# EAGLE design iomodul2 (EAGLE 6.5.0)
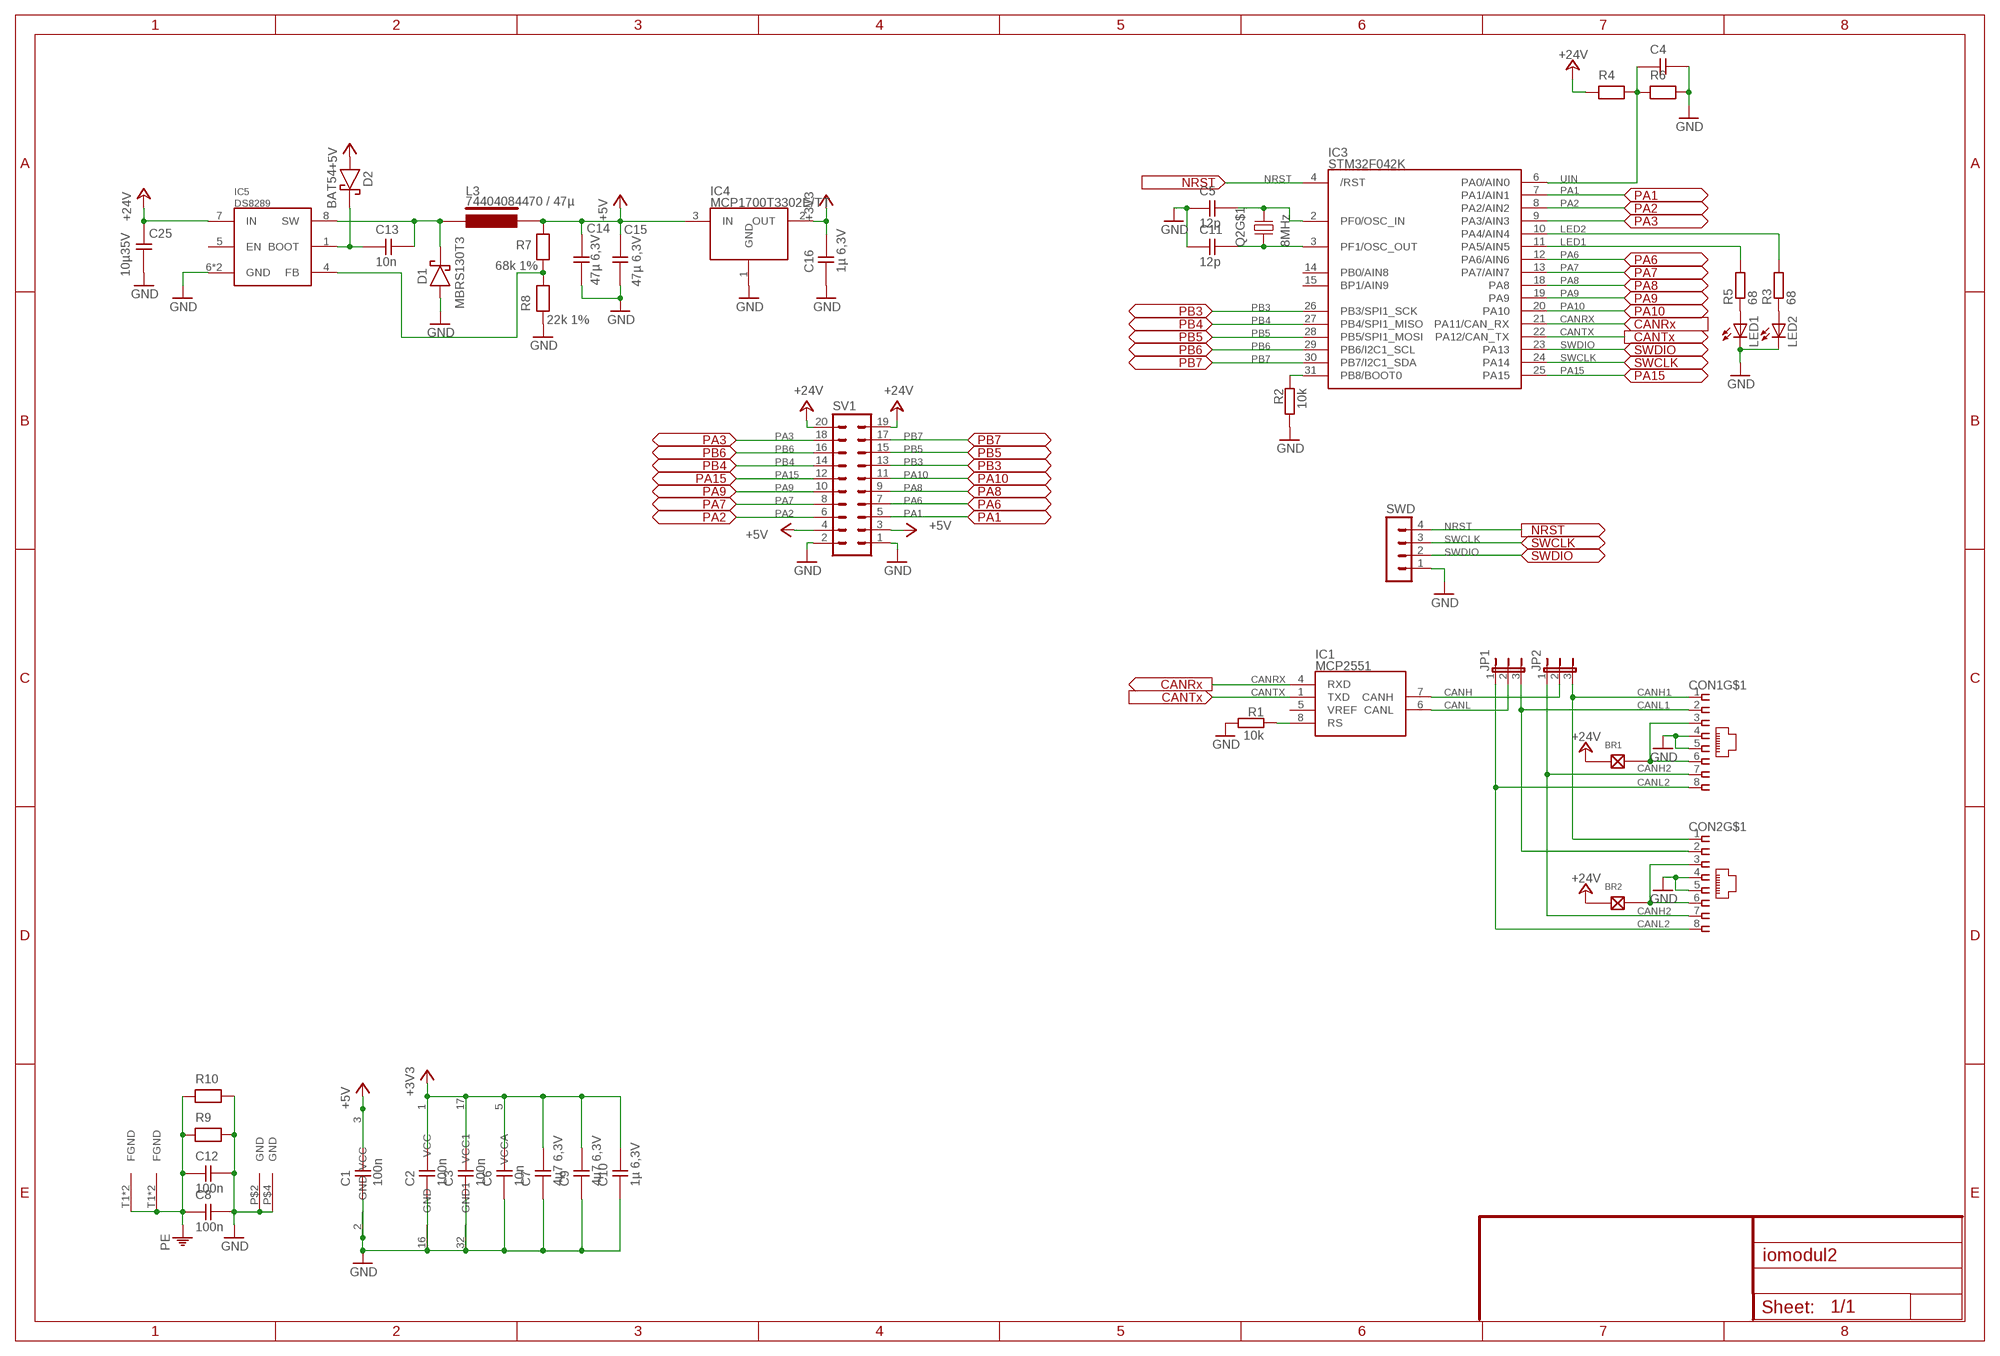
[diagram p0: schematic, sheet 1]

## Parts
BR1  LÖTBRÜCKE-S  [LÖTBRÜCKE]
BR2  LÖTBRÜCKE-S  [LÖTBRÜCKE]
C1  100n  CAP0603R  [0603REFLOW]
C2  100n  CAP0603R  [0603REFLOW]
C3  100n  CAP0603R  [0603REFLOW]
C4  CAP0603R  [0603REFLOW]
C5  12p  CAP0603R  [0603REFLOW]
C6  10n  CAP0603R  [0603REFLOW]
C7  4µ7 6,3V  CAP0603R  [0603REFLOW]
C8  100n  CAP0603R  [0603REFLOW]
C9  4µ7 6,3V  CAP0603R  [0603REFLOW]
C10  1µ 6,3V  CAP0603R  [0603REFLOW]
C11  12p  CAP0603R  [0603REFLOW]
C12  100n  CAP0603R  [0603REFLOW]
C13  10n  CAP0603R  [0603REFLOW]
C14  47µ 6,3V  CAP1210  [1210]
C15  47µ 6,3V  CAP1210  [1210]
C16  1µ 6,3V  CAP0603R  [0603REFLOW]
C25  10µ35V  CAP1206  [1206]
CON1  MEBP_8-8G  [MEBP]
CON2  MEBP_8-8G  [MEBP]
D1  MBRS130T3  [SMB]
D2  BAT54  [SOT23/32]
IC1  MCP2551  [SO-8]
IC3  STM32F042K  STM32F042  [LQFP32]
IC4  MCP1700T3302E/TT  MCP1700  [SOT23]
IC5  DS8289  [SO8-POWERPAD]
JP1  JP2E  [JP2]
JP2  JP2E  [JP2]
L3  74404084470 / 47µ  WE-LQS  [WE-LQS]
LED1  LEDCHIPLED_0603  [CHIPLED_0603]
LED2  LEDCHIPLED_0603  [CHIPLED_0603]
Q2  8MHz  MT-CRYSTAL  [MT-CRYSTAL]
R1  10k  R-EU_R0603  [R0603]
R2  10k  R-EU_R0603  [R0603]
R3  68  R-EU_R0603  [R0603]
R4  RES0603R  [0603REFLOW]
R5  68  R-EU_R0603  [R0603]
R6  RES0603R  [0603REFLOW]
R7  68k 1%  RES0603R  [0603REFLOW]
R8  22k 1%  RES0603R  [0603REFLOW]
R9  RES0603R  [0603REFLOW]
R10  RES0603R  [0603REFLOW]
SV1  MA10-2  [MA10-2]
SWD  MA04-1  [MA04-1]

## Nets
+3V3: C2.2 C3.2 C6.2 C7.2 C9.2 C10.2 C16.2 IC3.1(VCC) IC3.5(VCCA) IC3.17(VCC1) IC4.2(OUT)
+5V: C1.2 C14.2 C15.2 D2.1(A) IC1.3(VCC) IC4.3(IN) L3.P$2 R7.2 SV1.3 SV1.4
+24V: BR1.1 BR2.1 C25.2 IC5.7(IN) R4.1 SV1.19 SV1.20
CANH: IC1.7(CANH) JP2.2
CANH1: CON1.1 CON2.1 JP2.3
CANH2: CON1.7 CON2.7 JP2.1
CANL: IC1.6(CANL) JP1.2
CANL1: CON1.2 CON2.2 JP1.3
CANL2: CON1.8 CON2.8 JP1.1
CANRX: IC1.4(RXD) IC3.21(PA11/CAN_RX)
CANTX: IC1.1(TXD) IC3.22(PA12/CAN_TX)
GND: C1.1 C2.1 C3.1 C4.2 C5.1 C6.1 C7.1 C8.2 C9.1 C10.1 C11.1 C12.2 C14.1 C15.1 C16.1 C25.1 CON1.4 CON1.5 CON2.4 CON2.5 D1.A IC1.2(GND) IC3.16(GND) IC3.32(GND1) IC4.1(GND) IC5.6(GND) IC5.TP(GND) LED1.C LED2.C Q2.P$2(GND) Q2.P$4(GND) R1.2 R2.2 R6.2 R8.1 R9.2 R10.2 SV1.1 SV1.2 SWD.1
LED1: IC3.11(PA5/AIN5) R5.2
LED2: IC3.10(PA4/AIN4) R3.2
N$1: IC1.8(RS) R1.1
N$2: BR1.2 CON1.3 CON1.6
N$3: LED2.A R3.1
N$4: C11.2 IC3.3(PF1/OSC_OUT) Q2.P$1
N$5: C5.2 IC3.2(PF0/OSC_IN) Q2.P$3
N$6: BR2.2 CON2.3 CON2.6
N$7: LED1.A R5.1
N$12: C13.1 D2.3(K) IC5.1(BOOT)
N$13: C13.2 D1.K IC5.8(SW) L3.P$1
N$15: IC3.31(PB8/BOOT0) R2.1
N$18: IC5.4(FB) R7.1 R8.2
NRST: IC3.4(/RST) SWD.4
PA1: IC3.7(PA1/AIN1) SV1.5
PA2: IC3.8(PA2/AIN2) SV1.6
PA3: IC3.9(PA3/AIN3) SV1.18
PA6: IC3.12(PA6/AIN6) SV1.7
PA7: IC3.13(PA7/AIN7) SV1.8
PA8: IC3.18(PA8) SV1.9
PA9: IC3.19(PA9) SV1.10
PA10: IC3.20(PA10) SV1.11
PA15: IC3.25(PA15) SV1.12
PB3: IC3.26(PB3/SPI1_SCK) SV1.13
PB4: IC3.27(PB4/SPI1_MISO) SV1.14
PB5: IC3.28(PB5/SPI1_MOSI) SV1.15
PB6: IC3.29(PB6/I2C1_SCL) SV1.16
PB7: IC3.30(PB7/I2C1_SDA) SV1.17
PE: C8.1 C12.1 CON1.T1(FGND) CON1.T2(FGND) CON2.T1(FGND) CON2.T2(FGND) R9.1 R10.1
SWCLK: IC3.24(PA14) SWD.3
SWDIO: IC3.23(PA13) SWD.2
UIN: C4.1 IC3.6(PA0/AIN0) R4.2 R6.1
Unconnected: IC1.5(VREF) IC3.14(PB0/AIN8) IC3.15(BP1/AIN9) IC5.5(EN)

## Library data of the parts
BR1 BR2 = myspecial:LÖTBRÜCKE
C1-C13 C16 = mypassive-bleifrei:CAP0603
C14 C15 = MYPASS:CAP1210
C25 = MYPASS:CAP1206
CON1 CON2 = myconn:MEBP_8-8G: Reichelt RJ45 geschirmt MEBP 8-8G
D1 = MYDISCR:MBRS130T3
D2 = MYDISCR:BAT54
IC1 = MYMCHIP:MCP2551: CAN Transceiver
IC3 = MYSGS:STM32F042
IC4 = MYMCHIP:MCP1700: LDO 250mA
IC5 = MYRichtek:DS8289
JP1 JP2 = jumper:JP2E: JUMPER
L3 = myinductiv:WE-LQS
LED1 LED2 = led:LED: LED OSRAM: - CHIPLED LG R971, LG N971, LY N971, LG Q971, LY Q971, LO R971, LY R971 LH N974, LH R974 LS Q976, LO Q976, LY Q976 LO Q996 - Hyper CHIPLED LW Q18S LB Q993, LB Q99A, LB R99A - SideLED LS A670, LO A670, LY A670, LG A670, LP A670 LB A673, LV A673, LT A673, LW A673 LH A674 LY A675 LS A676, LA A676, LO A676, LY A676, LW A676 LS A679, LY A679, LG A679 - Hyper Micro SIDELED® LS Y876, LA Y876, LO Y876, LY Y876 LT Y87S - SmartLED LW L88C, LW L88S LB L89C, LB L89S, LG L890 LS L89K, LO L89K, LY L89K LS L896, LA L896, LO L896, LY L896 - TOPLED LS T670, LO T670, LY T670, LG T670, LP T670 LSG T670, LSP T670, LSY T670, LOP T670, LYG T670 LG T671, LOG T671, LSG T671 LB T673, LV T673, LT T673, LW T673 LH T674 LS T676, LA T676, LO T676, LY T676, LB T676, LH T676, LSB T676, LW T676 LB T67C, LV T67C, LT T67C, LS T67K, LO T67K, LY T67K, LW E67C LS E67B, LA E67B, LO E67B, LY E67B, LB E67C, LV E67C, LT E67C LW T67C LS T679, LY T679, LG T679 LS T770, LO T770, LY T770, LG T770, LP T770 LB T773, LV T773, LT T773, LW T773 LH T774 LS E675, LA E675, LY E675, LS T675 LS T776, LA T776, LO T776, LY T776, LB T776 LHGB T686 LT T68C, LB T68C - Hyper Mini TOPLED® LB M676 - Mini TOPLED Santana® LG M470 LS M47K, LO M47K, LY M47K Source: http://www.osram.convergy.de LUXEON: - LUMILED® LXK2-PW12-R00, LXK2-PW12-S00, LXK2-PW14-U00, LXK2-PW14-V00 LXK2-PM12-R00, LXK2-PM12-S00, LXK2-PM14-U00 LXK2-PE12-Q00, LXK2-PE12-R00, LXK2-PE12-S00, LXK2-PE14-T00, LXK2-PE14-U00 LXK2-PB12-K00, LXK2-PB12-L00, LXK2-PB12-M00, LXK2-PB14-N00, LXK2-PB14-P00, LXK2-PB14-Q00 LXK2-PR12-L00, LXK2-PR12-M00, LXK2-PR14-Q00, LXK2-PR14-R00 LXK2-PD12-Q00, LXK2-PD12-R00, LXK2-PD12-S00 LXK2-PH12-R00, LXK2-PH12-S00 LXK2-PL12-P00, LXK2-PL12-Q00, LXK2-PL12-R00 Source: www.luxeon.com KINGBRIGHT: KA-3528ASYC Source: www.kingbright.com
Q2 = MYPASS:MT-CRYSTAL: 3,2 x 2,5mm Reichelt
R1-R3 R5 = rcl:R-EU_: RESISTOR, European symbol
R4 R6-R10 = mypassive-bleifrei:RES0603
SV1 = con-lstb:MA10-2: PIN HEADER; OC_FARNELL: unknown; OC_NEWARK: unknown
SWD = con-lstb:MA04-1: PIN HEADER; OC_FARNELL: unknown; OC_NEWARK: unknown

## Board
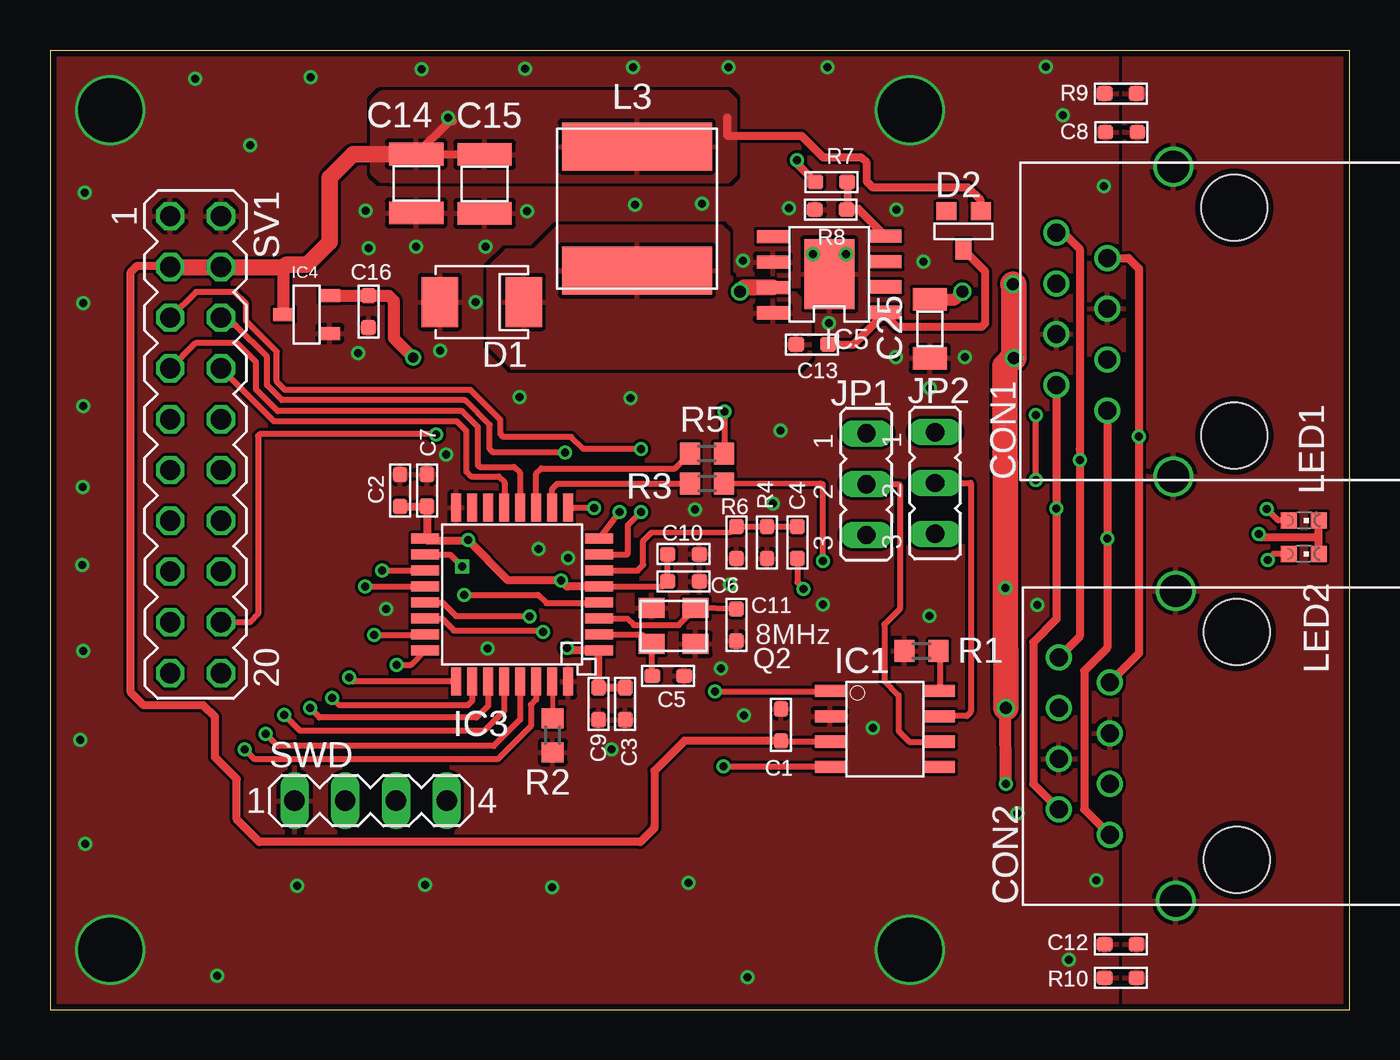
[diagram p1: board, top side]
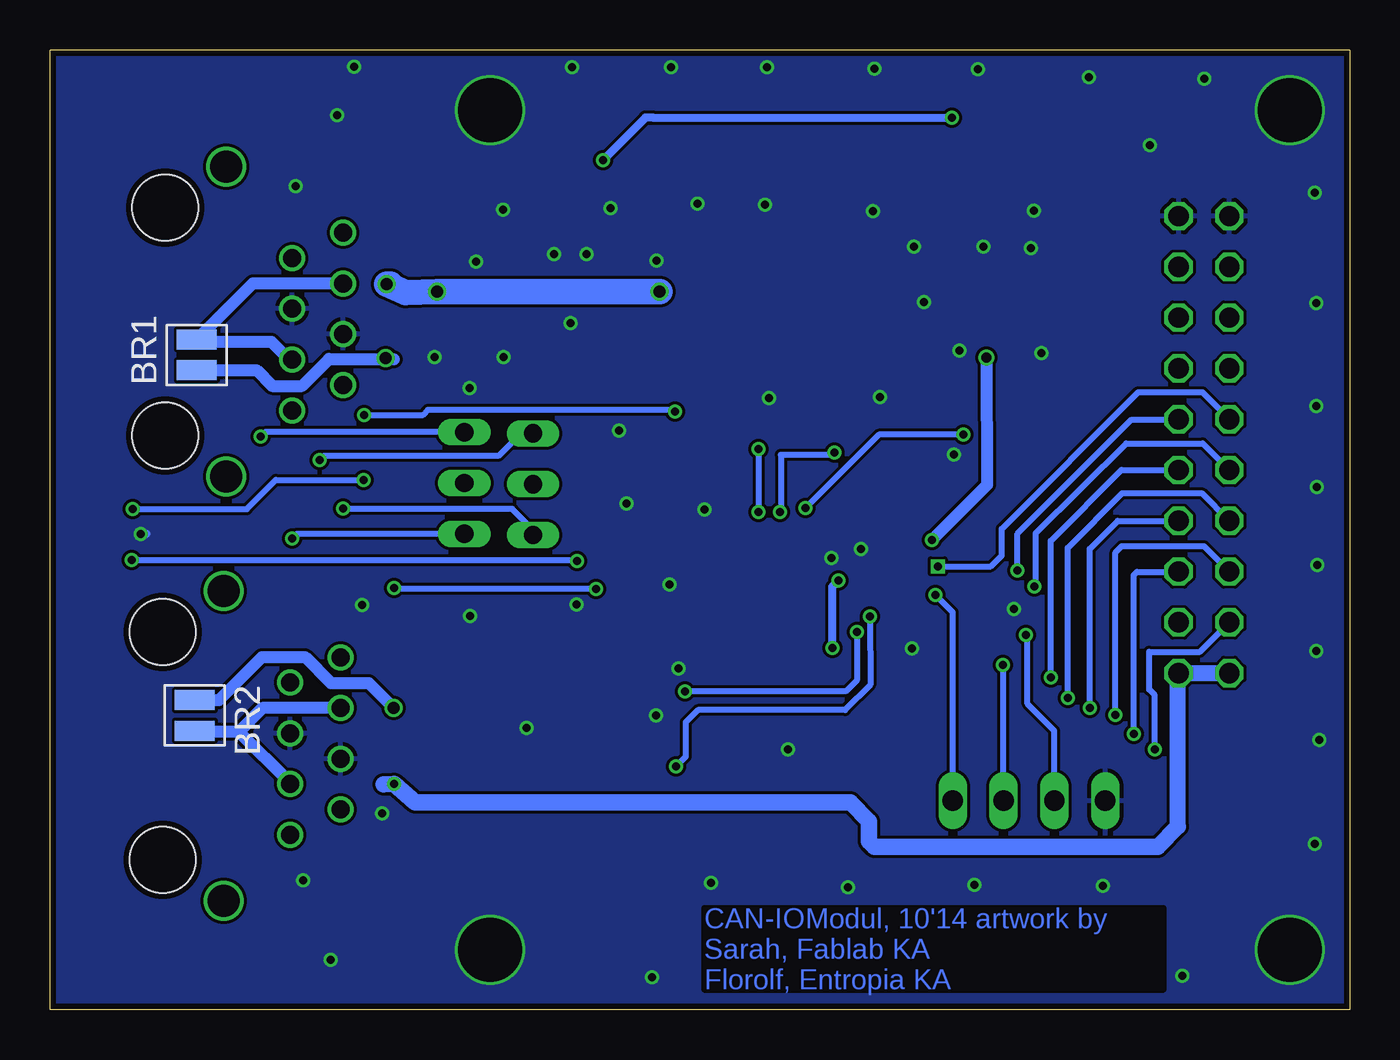
[diagram p2: board, bottom side, seen from below]

Size 65 x 48 mm. Coordinates in mm from the lower left corner, seen from the top.
Outline: 0,0 65,0 65,48 0,48 0,0
Copper layers (1*16): Top 0.035mm / dielectric 1.5mm / Bottom 0.035mm
Design rules "PCB-POOL Standard": minimum track width 0.15mm, minimum drill 0.3mm, track to track 0.15mm, track to pad 0.15mm, pad to pad 0.15mm, via to via 0.15mm, smd to smd 0.15mm, copper to edge 0.3mm, drill to drill 0.2mm, minimum pad ring 0.2mm, minimum via ring 0.15mm, stop-mask expansion 0.075mm, vias tented up to drill 0mil, thermal gap 0.2mm

### Footprints (pad centres in the part's own frame; a part is rotated, then mirrored left to right if it is on the bottom)
LÖTBRÜCKE = smd 1 x 2: 1 -0.77,0; 2 0.77,0
0603REFLOW = smd 0.8 x 0.75: 1 -0.8,0; 2 0.8,0
1210 = smd 1.143 x 2.718: 1 -1.473,0; 2 1.473,0
1206 = smd 1.143 x 1.702: 1 -1.473,0; 2 1.473,0
MEBP = drill 0.9: 1 -4.445,6.35; 2 -3.175,8.89; 3 -1.9,6.35; 4 -0.635,8.89; 5 0.635,6.35; 6 1.9,8.89; 7 3.175,6.35; 8 4.445,8.89 | drill 1.6: T1 -7.75,3.05; T2 7.75,3.05 | hole 3.3: -5.7,0; 5.7,0
SMB = smd 1.8 x 2.5: A 4.4,0; K 0.2,0
SOT23/32 = smd 1 x 0.9: 1 1.431,1.456; 2 -0.3,1.456 | smd 0.8 x 1: 3 0.565,-0.476
SO-8 = smd 0.61 x 1.524: 1 0,-0.203; 2 1.27,-0.203; 3 2.54,-0.203; 4 3.81,-0.203; 5 3.81,5.283; 6 2.54,5.283; 7 1.27,5.283; 8 0,5.283
LQFP32 = smd 1.4 x 0.5: 1 -4.35,2.8; 2 -4.35,2; 3 -4.35,1.2; 4 -4.35,0.4; 5 -4.35,-0.4; 6 -4.35,-1.2; 7 -4.35,-2; 8 -4.35,-2.8; 17 4.35,-2.8; 18 4.35,-2; 19 4.35,-1.2; 20 4.35,-0.4; 21 4.35,0.4; 22 4.35,1.2; 23 4.35,2; 24 4.35,2.8 | smd 0.5 x 1.4: 9 -2.8,-4.35; 10 -2,-4.35; 11 -1.2,-4.35; 12 -0.4,-4.35; 13 0.4,-4.35; 14 1.2,-4.35; 15 2,-4.35; 16 2.8,-4.35; 25 2.8,4.35; 26 2,4.35; 27 1.2,4.35; 28 0.4,4.35; 29 -0.4,4.35; 30 -1.2,4.35; 31 -2,4.35; 32 -2.8,4.35
SOT23 = smd 0.65 x 1.05: 1 -0.95,-1.15; 2 0.95,-1.15; 3 0,1.15
SO8-POWERPAD = smd 0.66 x 1.6: 1 -1.905,-2.819; 2 -0.635,-2.819; 3 0.635,-2.819; 4 1.905,-2.819; 5 1.88,2.819; 6 0.61,2.819; 7 -0.66,2.819; 8 -1.93,2.819 | smd 3.5 x 2.5: TP 0,0
JP2 = drill 0.914 long: 1 -2.54,0; 2 0,0; 3 2.54,0
WE-LQS = smd 2.4 x 7.5: P$1 3.1,0; P$2 -3.1,0
CHIPLED_0603 = smd 0.8 x 0.8: A 0,-0.75; C 0,0.75
MT-CRYSTAL = smd 1.3 x 1: P$1 0,0; P$2 2.2,0; P$3 2.2,1.8; P$4 0,1.8
R0603 = smd 1 x 1.1: 1 -0.85,0; 2 0.85,0
MA10-2 = drill 1.016 octagon: 1 -11.43,-1.27; 2 -11.43,1.27; 3 -8.89,-1.27; 4 -8.89,1.27; 5 -6.35,-1.27; 6 -6.35,1.27; 7 -3.81,-1.27; 8 -3.81,1.27; 9 -1.27,-1.27; 10 -1.27,1.27; 11 1.27,-1.27; 12 1.27,1.27; 13 3.81,-1.27; 14 3.81,1.27; 15 6.35,-1.27; 16 6.35,1.27; 17 8.89,-1.27; 18 8.89,1.27; 19 11.43,-1.27; 20 11.43,1.27
MA04-1 = drill 1.016 long: 1 -3.81,0; 2 -1.27,0; 3 1.27,0; 4 3.81,0

### Placement (x,y rotation side)
BR1  57.66,32.75 90 bottom
BR2  57.76,14.71 270 bottom
C1  36.56,14.24 270 top
C2  17.51,25.96 270 top
C3  28.77,15.3 90 top
C4  35.86,23.36 270 top
C5  30.92,16.69 180 top
C6  31.69,21.42 180 top
C7  18.85,25.97 270 top
C8  53.59,43.89 180 top
C9  27.44,15.3 90 top
C10  31.69,22.78 180 top
C11  34.33,19.24 90 top
C12  53.55,3.26 180 top
C13  38.12,33.27 180 top
C14  18.32,41.32 90 top
C15  21.74,41.3 90 top
C16  15.93,34.91 90 top
C25  44.01,34.05 90 top
CON1  59.23,34.42 90 top
CON2  59.35,13.18 90 top
D1  23.9,35.4 180 top
D2  45.13,38.48 0 top
IC1  39.22,15.94 270 top
IC3  23.12,20.76 180 top
IC4  12.84,34.77 90 top
IC5  38.98,36.78 90 top
JP1  40.84,26.28 270 top
JP2  44.27,26.34 270 top
L3  29.35,40.07 270 top
LED1  62.72,24.46 270 top
LED2  62.71,22.79 270 top
Q2  32.29,20.08 180 top
R1  43.59,17.93 180 top
R2  25.14,13.72 270 top
R3  32.87,26.31 180 top
R4  37.38,23.36 90 top
R5  32.85,27.81 180 top
R6  34.34,23.36 270 top
R7  39.08,41.4 180 top
R8  39.05,40.01 0 top
R9  53.55,45.82 180 top
R10  53.55,1.59 180 top
SV1  7.28,28.26 270 top
SWD  16.04,10.45 0 top

### Tracks (layer width: path | path; a pad name or v marks a point on that pad's centre or on a via)
+3V3  (via drill 0.4, 0.5)
  Top 0.3: IC3.5 30.63,21.16 C6.2 C10.2
  Top 0.4: IC3.17 18.85,23.64 C7.2 C2.2 | C3.2 C9.2 27.44,17.93 IC3.1
  Top 0.406: IC3.17 18.88,23.45 20.92,23.45 v20.9,23.48 22.9,21.47 v25.56,21.47 25.87,21.16 IC3.5 | IC3.1 26,17.96 v25.87,18.09
  Top 0.61: IC4.2 C16.2 16.94,35.71 17.19,35.46 17.19,33.6 v18.16,32.61
  Bottom 0.406: v20.91,23.48 v20.9,23.48 | v25.87,18.09 25.87,21.16 v25.56,21.47
  Bottom 0.61: v18.16,32.61 18.13,26.24 v20.9,23.48
+5V  (via drill 0.4)
  Top 0.3: IC1.3 36.6,13.4 C1.2
  Top 0.4: v19.9,44.61 19.96,44.61 20.15,44.42 | 30.23,9.18 30.23,9.08 29.53,8.38 10.47,8.38 9.34,9.51 9.34,11.53 8.25,12.62 8.25,14.64 7.67,15.22 4.68,15.22 4.04,15.86 4.04,36.89 | 4.35,37.2 5.96,37.2 SV1.3 | v37.35,42.49 37.41,42.49 37.41,42.27 R7.2 | D2.1 46.56,40.48 45.92,41.12 41.15,41.12 40.85,41.42 40.85,42.35 40.58,42.62 38.68,42.62 37.61,43.69 33.91,43.69 33.88,43.72 33.88,44.62 | 33.88,44.62
  Top 0.406: v19.9,44.61 19.9,44.37 C14.2 18.42,42.69 18.93,42.69 19.01,42.77 C15.2 | C1.2 31.73,13.44 30.23,11.94 30.23,9.18 | 4.04,36.89 4.35,37.2
  Top 0.61: IC4.3 11.69,37.11 11.84,37.26
  Top 0.8: SV1.3 SV1.4 11.65,37.15 11.69,37.11
  Top 0.813: C14.2 15.17,42.79 13.99,41.61 13.99,38.38 12.87,37.26 11.84,37.26
  Bottom 0.4: v19.9,44.61 34.86,44.62 35.22,44.62 v37.35,42.49
  pour Top (rank 3): 17.08,41.46 33.91,41.46 34.27,41.82 34.27,45.45 33.87,45.85 16.59,45.85 16.12,45.38 16.12,41.9 16.54,41.48 17.06,41.48
+24V  (via drill 0.4, 0.6)
  Top 0.3: 47.62,22.67 47.79,22.84 | R4.1 37.38,21.38 v37.69,21.05 | 47.8,21.69 47.8,22.06 47.79,22.06 | v47.8,21.08 47.8,20.57
  Top 0.6: C25.2 45.25,35.52 v45.64,35.91 | v47.8,11.3 47.78,15.05 v47.81,15.08
  Top 0.8: IC5.7 34.72,36.12 v34.51,35.91
  Top 1.27: v47.81,15.08 v47.8,21.08 47.8,21.69 47.79,22.84 47.75,32.19 48.14,32.58 v48.2,32.58 48.2,36.26 v48.17,36.3
  Bottom 0.3: v37.69,21.05 47.77,21.05 v47.8,21.08
  Bottom 0.6: 47.81,32.52 v48.2,32.58 48.23,32.55 51.04,32.55 52.39,31.2 53.89,31.2 54.67,31.98 BR1.1 | 48.31,11.28 v47.8,11.3 | BR2.1 56.55,15.48 54.4,17.63 52.25,17.63 50.95,16.33 49.06,16.33 v47.81,15.08
  Bottom 0.8: 8.58,9.16 8.58,16.8 SV1.20 SV1.19
  Bottom 0.813: 48.31,11.26 v47.8,11.3 46.73,10.36 24.97,10.36 24.03,9.42 24.03,8.41 23.76,8.14 9.6,8.14 8.58,9.16
  Bottom 1.27: 34.49,35.91 v34.51,35.91 v45.64,35.91 47.2,35.87 v48.17,36.3 47.97,36.29
CANH
  Top 0.3: JP2.2 46.05,26.34 46.06,26.33 46.06,14.89 45.85,14.68 44.51,14.68 IC1.7
CANH1  (via drill 0.4)
  Top 0.406: CON1.1 v52.88,23.57 52.88,23.32 52.88,18.09 51.73,16.94 51.73,10.01 CON2.1
  Bottom 0.3: JP2.3 52.65,23.8 v52.88,23.57
CANH2  (via drill 0.4)
  Top 0.406: CON1.7 53.95,37.59 54.47,37.07 54.47,29.8 v54.47,28.67 54.47,17.82 CON2.7
  Bottom 0.3: JP2.1 54.26,28.88 v54.47,28.67
CANL
  Top 0.3: JP1.2 42.46,26.28 42.51,26.23 42.51,20.05 41.73,19.27 41.73,16.43 42.44,15.72 42.44,13.94 42.98,13.4 IC1.6
CANL1  (via drill 0.4)
  Top 0.406: CON1.2 50.34,25.68 v50.34,25.07 50.34,19.53 49.18,18.37 49.18,11.29 CON2.2
  Bottom 0.3: JP1.3 40.84,24 41.88,25.04 50.31,25.04 v50.34,25.07
CANL2  (via drill 0.4)
  Top 0.406: CON1.8 50.7,38.87 51.51,38.05 51.51,28.04 v51.51,27.48 51.51,18.68 CON2.8
  Bottom 0.3: JP1.1 41.45,28.82 42.57,27.7 51.29,27.7 v51.51,27.48
CANRX  (via drill 0.4)
  Top 0.3: v33.69,12.16 38.99,12.16 IC1.4 | IC3.21 19.63,20.36 20.31,19.68 v23.98,19.68 v23.99,19.67
  Bottom 0.3: v23.99,19.67 23.97,16.24 25.23,14.98 32.6,14.98 33.21,14.37 33.21,12.64 v33.69,12.16
CANTX  (via drill 0.4)
  Top 0.3: v33.25,15.92 39,15.92 IC1.1 | IC3.22 19.6,19.56 20.2,18.96 24.46,18.96 v24.65,18.88
  Bottom 0.3: v24.65,18.88 24.65,16.46 25.19,15.92 v33.25,15.92
GND  (via drill 0.4, 3.2)
  Top 0.4: 63.46,23.62 LED1.C | LED2.C 63.46,23.62 | 63.46,23.62 60.62,23.62 v60.46,23.78
  Bottom 0.4: v60.46,23.78 60.2,23.78 60.18,23.8
  other vias: 7.27,46.56 10,43.23 13.03,46.64 18.59,47.05 23.77,47.06 29.15,47.14 50.65,44.73 52.7,41.19 43.98,19.68 48.38,9.81 52.34,6.46 50.97,2.48 41.16,14.08 34.88,1.61 31.93,6.34 25.1,6.12 18.76,6.24 12.35,6.2 34.01,21.27 8.37,1.69 1.75,8.3 1.52,13.49 1.67,17.93 1.61,22.23 1.64,26.13 1.67,30.19 1.67,35.34 1.74,40.85 15.79,39.96 18.31,38.16 21.78,38.16 23.85,39.93 32.61,40.32 43.68,37.42 21.29,35.4 19.51,32.95 36.54,28.96 15.94,38.08 15.41,32.84 42.31,32.64 44.01,31.1 45.76,32.64 36.97,40.08 33.56,17.07 19.8,27.76 3,3 3,45 43,3 33.94,47.13 38.89,47.13 49.39,20.25 49.8,47.17 23.49,30.65 29.03,30.6 29.25,40.26 42.33,40.02 28.09,13.01 38.67,20.26 16.8,20.05 25.91,22.59 21.89,18.07 24.43,23.05 43,45 34.7,14.72 36.17,25.31 32.27,25.01 38.16,37.79 39.8,37.78 38.96,34.35 34.66,37.46
  pour Top (rank 5): -0.01,47.96 53.11,47.96 53.66,47.35 53.75,0.76 53.05,0.05 0.03,0.05 0.02,7.33 0.02,46.32 0.03,46.33
  pour Bottom (rank 3): 0,48 64.95,48 65.02,0 0.07,0
LED1
  Top 0.3: IC3.11 24.32,26.81 24.58,27.07 31.27,27.07 R5.2
LED2
  Top 0.3: IC3.10 25.12,26.05 25.38,26.31 R3.2
N$1
  Top 0.3: R1.1 44.5,17.93 IC1.8
N$2
  Bottom 0.6: CON1.6 54.86,36.32 BR1.2 | 57.64,33.5 BR1.2 | CON1.3 53.05,32.52 53.92,33.39 57.53,33.39 BR1.2
N$3  (via drill 0.4)
  Top 0.3: LED2.A 61.2,22.79 v60.91,22.5 | v38.65,22.45 38.65,26.27 38.51,26.31 R3.1
  Bottom 0.3: v60.91,22.5 38.7,22.5 v38.65,22.45
N$4
  Top 0.3: IC3.3 28.87,19.56 29.2,19.23 31.44,19.23 Q2.P$1 C11.2
N$5
  Top 0.3: IC3.2 29.61,18.76 Q2.P$3 30.12,18.25 C5.2
N$6
  Bottom 0.6: CON2.6 54.39,15.08 55.57,13.9 | 55.57,13.9 57.72,13.9 BR2.2 | CON2.3 53,11.33 55.57,13.9
N$7  (via drill 0.4)
  Top 0.3: LED1.A 61.44,24.46 v60.87,25.03 | v49.32,26.49 49.32,29.73 v49.3,29.75 | v33.73,29.91 33.73,27.84 R5.1
  Bottom 0.3: v60.87,25.03 55.16,25.03 53.7,26.49 v49.32,26.49 | v49.3,29.75 46.35,29.75 46.09,30.01 33.83,30.01 v33.73,29.91
N$12
  Top 0.4: C13.1 40.19,33.27 IC5.1 41.8,34.7 42.34,34.16 46.61,34.16 46.78,34.33 46.78,36.92 D2.3
N$13
  pour Top (rank 4): 25.47,39.17 33.57,39.17 33.88,38.86 33.88,36.74 34.65,35.97 37.12,35.97 37.93,35.16 37.98,32.65 37.44,32.11 23.16,32.08 21.97,33.27 21.97,37.08 22.86,37.97 24.27,37.97
N$15
  Top 0.254: IC3.31 25.14,16.41 R2.1
N$18
  Top 0.4: R7.1 39.88,40.04 | 39.88,40.04 R8.2 | 39.88,40.04 40.44,40.04 IC5.4
NRST  (via drill 0.4)
  Top 0.3: v20.72,20.75 24.41,20.75 24.83,20.33 27.44,20.33 IC3.4
  Bottom 0.3: SWD.4 19.84,19.88 v20.72,20.75
PA1  (via drill 0.4)
  Top 0.3: IC3.7 28.86,22.76 28.91,22.81 28.91,24.23 v29.56,24.88 | v29.56,28.04 26.68,28.04 26.07,28.65 22.67,28.65 22.53,28.79 22.53,29.49 21.03,30.99 11.76,30.99 11.34,31.41 11.34,32.91 9.81,34.44 9.81,35.33 9.24,35.9 7.3,35.9 SV1.5
  Bottom 0.3: v29.56,28.04 v29.56,24.88
PA2  (via drill 0.4)
  Top 0.3: v28.48,24.88 27.49,23.58 IC3.8 | v25.77,27.87 22.17,27.87 21.99,28.05 21.99,29.25 20.76,30.48 11.61,30.48 10.86,31.23 10.86,32.66 9.27,34.25 8.91,34.25 SV1.6
  Bottom 0.3: v28.48,24.88 28.45,25.11 28.45,27.76 25.88,27.76 v25.77,27.87
PA3  (via drill 0.4)
  Top 0.3: v19.32,28.76 19.3,28.78 10.49,28.78 10.41,28.7 10.41,19.78 10,19.37 SV1.18 | v27.21,25.1 IC3.9
  Bottom 0.3: v19.32,28.76 23.55,28.76 v27.21,25.1
PA6
  Top 0.3: IC3.12 23.5,25.13 23.5,26.86 23.21,27.15 21.49,27.15 21.41,27.23 21.41,29.14 20.62,29.93 11.39,29.93 10.3,31.02 10.3,32.39 9.36,33.33 7.27,33.33 SV1.7
PA7
  Top 0.3: IC3.13 22.73,26.38 22.44,26.67 21.07,26.67 20.83,26.91 20.83,28.94 20.35,29.42 11.2,29.42 SV1.8
PA8  (via drill 0.4)
  Top 0.3: IC3.18 20.01,22.76 v20.6,22.17
  Bottom 0.3: v20.6,22.17 17.94,22.17 17.4,22.71 17.4,24.05 10.57,30.88 7.36,30.88 SV1.9
PA9  (via drill 0.4)
  Top 0.3: v16.61,21.96 IC3.19
  Bottom 0.3: v16.61,21.96 16.61,23.81 10.91,29.51 8.57,29.51 SV1.10
PA10  (via drill 0.4)
  Top 0.3: v15.77,21.16 IC3.20
  Bottom 0.3: v15.77,21.16 15.69,21.24 15.69,23.83 11.17,28.32 7.34,28.32 SV1.11
PA15  (via drill 0.4)
  Top 0.3: IC3.25 15.15,16.41 v14.95,16.61
  Bottom 0.3: v14.95,16.61 14.95,23.45 11.41,26.99 SV1.12
PB3  (via drill 0.4)
  Top 0.3: IC3.26 21.12,15.45 20.89,15.22 14.47,15.22 v14.1,15.59
  Bottom 0.3: v14.1,15.59 14.1,23.1 11.37,25.83 7.39,25.83 SV1.13
PB4  (via drill 0.4)
  Top 0.3: IC3.27 21.92,15.2 21.33,14.61 13.48,14.61 v13,15.09
  Bottom 0.3: v13,15.09 13,23.05 12.98,23.05 11.59,24.44 SV1.14
PB5  (via drill 0.4)
  Top 0.3: IC3.28 22.72,14.94 21.72,13.94 12.5,13.94 v11.71,14.73
  Bottom 0.3: v11.71,14.73 11.71,22.87 11.4,23.18 7.28,23.18 SV1.15
PB6  (via drill 0.4)
  Top 0.3: IC3.29 23.52,14.51 22.19,13.18 11.39,13.18 v10.79,13.78
  Bottom 0.3: v10.79,13.78 10.79,21.73 10.63,21.89 8.57,21.89 SV1.16
PB7  (via drill 0.4)
  Top 0.3: IC3.30 24.32,15.51 24.06,15.25 24.06,14.2 22.38,12.52 10.24,12.52 v9.74,13.02
  Bottom 0.3: v9.74,13.02 9.74,15.73 10.02,16.01 10.02,17.9 7.48,17.9 SV1.17
PE
  pour Top (rank 4): 53.77,48 65,48 65,0 53.77,0
SWCLK  (via drill 0.4)
  Top 0.3: v17.33,17.24 18.05,17.24 IC3.24
  Bottom 0.3: SWD.3 17.3,17.21 v17.33,17.24
SWDIO  (via drill 0.4)
  Top 0.3: v16.2,18.75 IC3.23
  Bottom 0.3: SWD.2 14.77,13.95 16.11,15.29 16.11,18.66 v16.2,18.75
UIN
  Top 0.3: IC3.6 29.39,21.96 29.67,22.24 29.67,23.44 30.09,23.86 34.07,23.89 R6.1 C4.1 | 35.88,24.18 C4.1 | C4.1 R4.2

### Text on the board
Bottom: CAN-IOModul, 10'14 artwork by / Sarah, Fablab KA / Florolf, Entropia KA
_tPlace: IC4
_tNames: R9 | L3 | C14 | C15 | C8 | R7 | SV1 | D2 | R8 | C16 | IC5 | D1 | C13 | C25 | R5 | JP1 | JP2 | C7 | C2 | R3 | CON1 | LED1 | R6 | R4 | C4 | C10 | C6 | C11 | R1 | Q2 | IC1 | LED2 | C5 | IC3 | SWD | C9 | C3 | C1 | R2 | CON2 | C12 | R10
_bNames: BR1 | BR2